# EAGLE schematic Hercules (EAGLE 7.2.0)
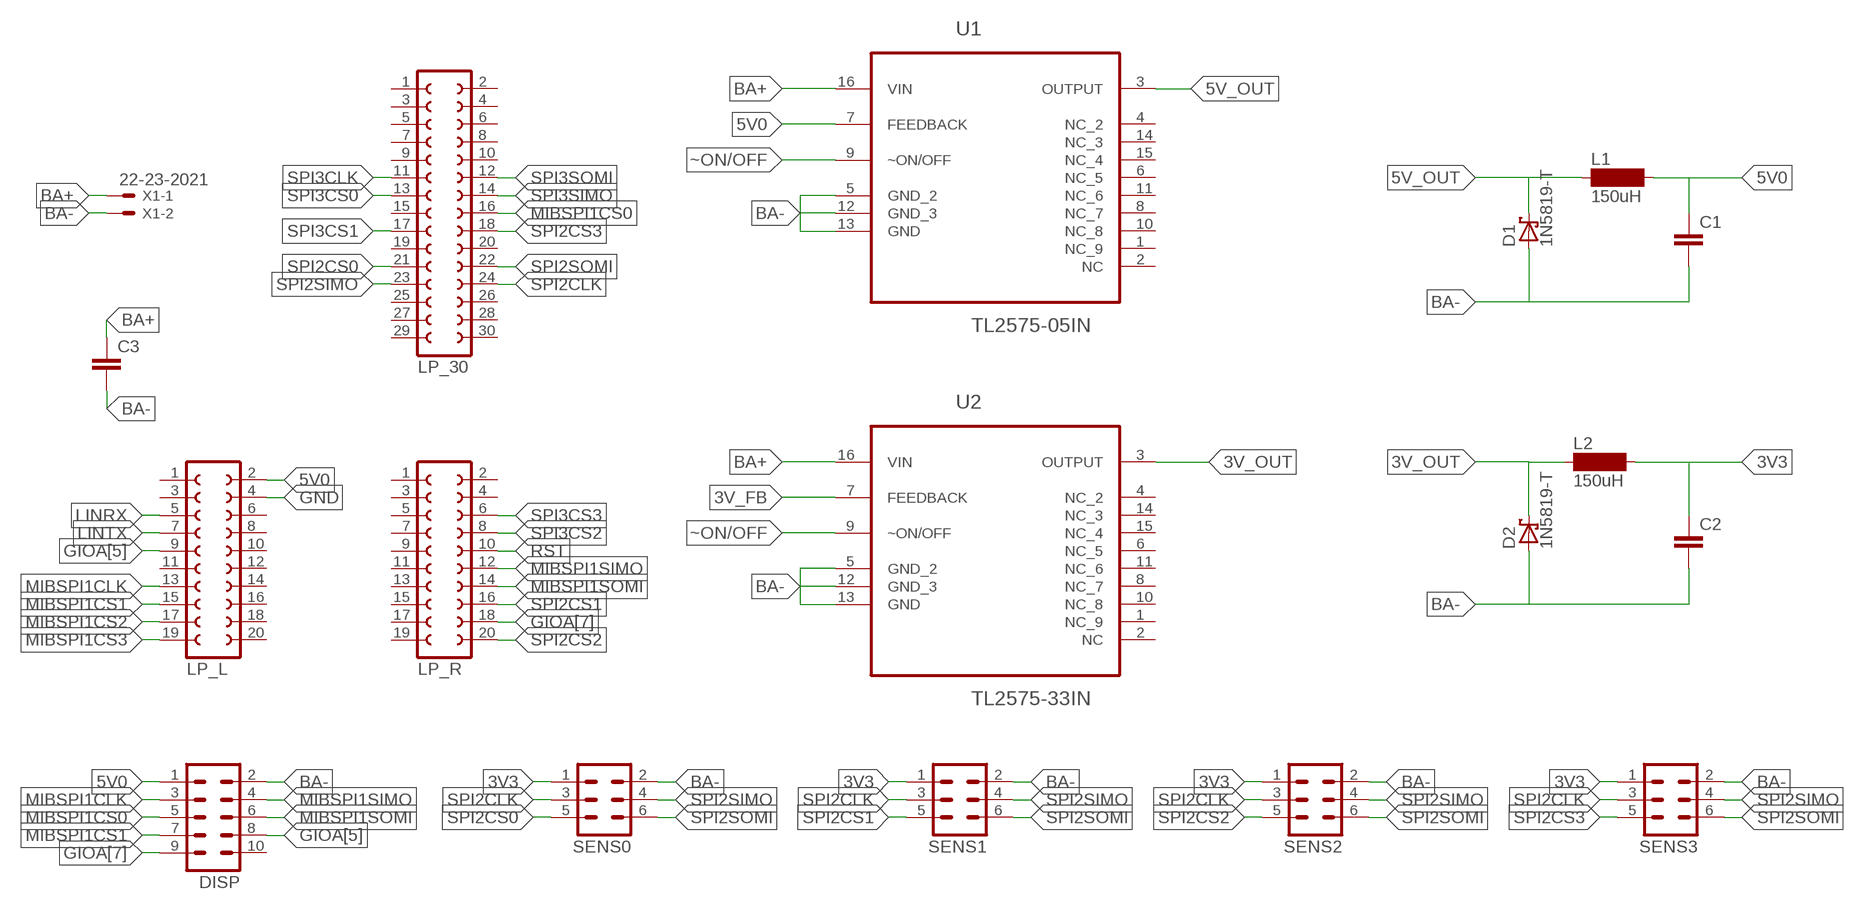
[diagram p0: schematic, sheet 1]

## Parts
C1  C7.5/6  [C7.5B6]
C2  C7.5/6  [C7.5B6]
C3  C2.5/5  [C2.5-5]
D1  1N5819-T  [DO41-7.6]
D2  1N5819-T  [DO41-7.6]
DISP  MA05-2  [MA05-2]
L1  150uH  BS75  [BS75]
L2  150uH  BS75  [BS75]
LP_30  FE15-2  [FE15-2]
LP_L  FE10-2  [FE10-2]
LP_R  FE10-2  [FE10-2]
SENS0  MA03-2  [MA03-2]
SENS1  MA03-2  [MA03-2]
SENS2  MA03-2  [MA03-2]
SENS3  MA03-2  [MA03-2]
U1  TL2575-05IN  [DIP254P762X508-16]
U2  TL2575-33IN  [DIP254P762X508-16]
X1  22-23-2021  [22-23-2021]

## Nets
3V3: C2.1 L2.2 SENS0.1 SENS1.1 SENS2.1 SENS3.1
3V_FB: U2.7(FEEDBACK)
3V_OUT: D2.C L2.1 U2.3(OUTPUT)
5V0: C1.1 DISP.1 L1.2 LP_L.2 U1.7(FEEDBACK)
5V_OUT: D1.C L1.1 U1.3(OUTPUT)
BA+: C3.1 U1.16(VIN) U2.16(VIN) X1.1
BA-: C1.2 C2.2 C3.2 D1.A D2.A DISP.2 SENS0.2 SENS1.2 SENS2.2 SENS3.2 U1.5(GND_2) U1.12(GND_3) U1.13(GND) U2.5(GND_2) U2.12(GND_3) U2.13(GND) X1.2
GIOA[5]: DISP.8 LP_L.9
GIOA[7]: DISP.9 LP_R.18
GND: LP_L.4
LINRX: LP_L.5
LINTX: LP_L.7
MIBSPI1CLK: DISP.3 LP_L.13
MIBSPI1CS0: DISP.5 LP_30.16
MIBSPI1CS1: DISP.7 LP_L.15
MIBSPI1CS2: LP_L.17
MIBSPI1CS3: LP_L.19
MIBSPI1SIMO: DISP.4 LP_R.12
MIBSPI1SOMI: DISP.6 LP_R.14
RST: LP_R.10
SPI2CLK: LP_30.24 SENS0.3 SENS1.3 SENS2.3 SENS3.3
SPI2CS0: LP_30.21 SENS0.5
SPI2CS1: LP_R.16 SENS1.5
SPI2CS2: LP_R.20 SENS2.5
SPI2CS3: LP_30.18 SENS3.5
SPI2SIMO: LP_30.23 SENS0.4 SENS1.4 SENS2.4 SENS3.4
SPI2SOMI: LP_30.22 SENS0.6 SENS1.6 SENS2.6 SENS3.6
SPI3CLK: LP_30.11
SPI3CS0: LP_30.13
SPI3CS1: LP_30.17
SPI3CS2: LP_R.8
SPI3CS3: LP_R.6
SPI3SIMO: LP_30.14
SPI3SOMI: LP_30.12
~ON/OFF: U1.9(~ON/OFF) U2.9(~ON/OFF)
Unconnected: DISP.10 LP_30.1 LP_30.2 LP_30.3 LP_30.4 LP_30.5 LP_30.6 LP_30.7 LP_30.8 LP_30.9 LP_30.10 LP_30.15 LP_30.19 LP_30.20 LP_30.25 LP_30.26 LP_30.27 LP_30.28 LP_30.29 LP_30.30 LP_L.1 LP_L.3 LP_L.6 LP_L.8 LP_L.10 LP_L.11 LP_L.12 LP_L.14 LP_L.16 LP_L.18 LP_L.20 LP_R.1 LP_R.2 LP_R.3 LP_R.4 LP_R.5 LP_R.7 LP_R.9 LP_R.11 LP_R.13 LP_R.15 LP_R.17 LP_R.19 U1.1(NC_9) U1.2(NC) U1.4(NC_2) U1.6(NC_5) U1.8(NC_7) U1.10(NC_8) U1.11(NC_6) U1.14(NC_3) U1.15(NC_4) U2.1(NC_9) U2.2(NC) U2.4(NC_2) U2.6(NC_5) U2.8(NC_7) U2.10(NC_8) U2.11(NC_6) U2.14(NC_3) U2.15(NC_4)

## Library data of the parts
C1-C3 = capacitor-wima:C: CAPACITOR naming: grid - package width
D1 D2 = diode:1N581*: 1.0A SCHOTTKY BARRIER RECTIFIER Source: http://www.diodes.com/datasheets/ds23001.pdf
DISP = con-lstb:MA05-2: PIN HEADER; OC_FARNELL: unknown; OC_NEWARK: unknown
L1 L2 = inductor-neosid:BS: INDUCTOR nominal inductance, magnetically screened; OC_FARNELL: unknown; OC_NEWARK: unknown
LP_30 = con-lsta:FE15-2: FEMALE HEADER; OC_FARNELL: unknown; OC_NEWARK: unknown
LP_L LP_R = con-lsta:FE10-2: FEMALE HEADER; OC_FARNELL: unknown; OC_NEWARK: unknown
SENS0 SENS1-SENS3 = con-lstb:MA03-2: PIN HEADER; OC_FARNELL: unknown; OC_NEWARK: unknown
U1 = baja:TL2575-05IN: 1-A SIMPLE STEP-DOWN SWITCHING VOLTAGE REGULATORS; MPN: TL2575HV-05IN; OC_FARNELL: -; OC_NEWARK: 27M1040; PACKAGE: PDIP-16; SUPPLIER: Texas Instruments
U2 = baja:TL2575-33IN: 1-A SIMPLE STEP-DOWN SWITCHING VOLTAGE REGULATORS; MPN: TL2575HV-05IN; OC_FARNELL: -; OC_NEWARK: 27M1040; PACKAGE: PDIP-16; SUPPLIER: Texas Instruments
X1 = con-molex:22-23-2021: .100" (2.54mm) Center Header - 2 Pin; MF: MOLEX; MPN: 22-23-2021; OC_FARNELL: 1462926; OC_NEWARK: 25C3832